# Altium schematic sheet STM32_NEW.SchDoc
size A4
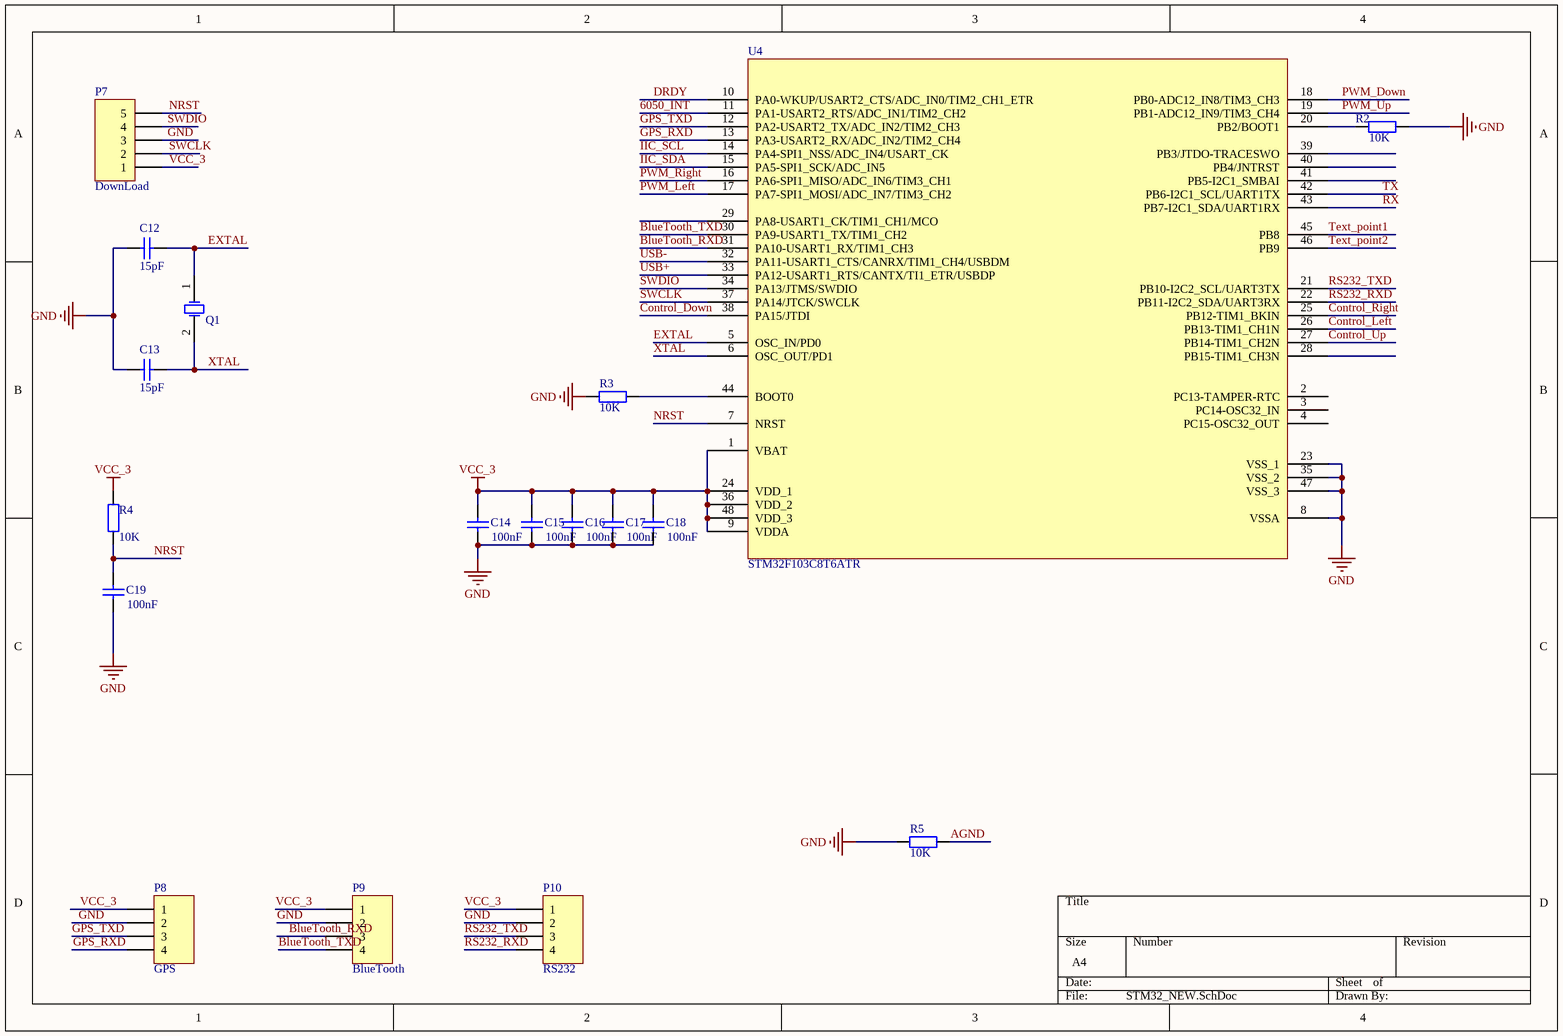
[diagram p0: STM32_NEW.SchDoc]

## Parts
C12  value 15pF  [0603]  (hidden comment: 1pF)
C13  value 15pF  [0603]  (hidden comment: 1pF)
C14  value 100nF  [0603]  (hidden comment: Cap)
C15  value 100nF  [0603]  (hidden comment: Cap)
C16  value 100nF  [0603]  (hidden comment: Cap)
C17  value 100nF  [0603]  (hidden comment: Cap)
C18  value 100nF  [0603]  (hidden comment: Cap)
C19  value 100nF  [0603]  (hidden comment: Cap)
P7  DownLoad  [HDR1X5]
P8  GPS  [HDR1X4]
P9  BlueTooth  [HDR1X4]
P10  RS232  [HDR1X4]
Q1  XTAL  [xtal-5032]  (value not drawn)
R2  value 10K  [0603]  (hidden comment: Res2)
R3  value 10K  [0603]  (hidden comment: Res2)
R4  value 10K  [0603]  (hidden comment: Res2)
R5  value 10K  [0603]  (hidden comment: Res2)
U4  STM32F103C8T6ATR

## Nets
GND: C12.1 C13.1 C14.1 C15.1 C16.1 C17.1 C18.1 C19.1 P7.3 P8.2 P9.2 P10.2 R2.1 R3.2 R5.2 U4.8(VSSA) U4.23(VSS_1) U4.35(VSS_2) U4.47(VSS_3)
VCC_3: C14.2 C15.2 C16.2 C17.2 C18.2 P7.1 P8.1 P9.1 P10.1 R4.2 U4.1(VBAT) U4.9(VDDA) U4.24(VDD_1) U4.36(VDD_2) U4.48(VDD_3)
6050_INT: U4.11(PA1-USART2_RTS/ADC_IN1/TIM2_CH2)
AGND: R5.1
BlueTooth_RXD: P9.3 U4.31(PA10-USART1_RX/TIM1_CH3)
BlueTooth_TXD: P9.4 U4.30(PA9-USART1_TX/TIM1_CH2)
Control_Down: U4.38(PA15/JTDI)
Control_Left: U4.26(PB13-TIM1_CH1N)
Control_Right: U4.25(PB12-TIM1_BKIN)
Control_Up: U4.27(PB14-TIM1_CH2N)
DRDY: U4.10(PA0-WKUP/USART2_CTS/ADC_IN0/TIM2_CH1_ETR)
EXTAL: C12.2 Q1.1(OSC1) U4.5(OSC_IN/PD0)
GPS_RXD: P8.4 U4.13(PA3-USART2_RX/ADC_IN2/TIM2_CH4)
GPS_TXD: P8.3 U4.12(PA2-USART2_TX/ADC_IN2/TIM2_CH3)
IIC_SCL: U4.14(PA4-SPI1_NSS/ADC_IN4/USART_CK)
IIC_SDA: U4.15(PA5-SPI1_SCK/ADC_IN5)
NRST: C19.2 P7.5 R4.1 U4.7(NRST)
PWM_Down: U4.18(PB0-ADC12_IN8/TIM3_CH3)
PWM_Left: U4.17(PA7-SPI1_MOSI/ADC_IN7/TIM3_CH2)
PWM_Right: U4.16(PA6-SPI1_MISO/ADC_IN6/TIM3_CH1)
PWM_Up: U4.19(PB1-ADC12_IN9/TIM3_CH4)
RS232_RXD: P10.4 U4.22(PB11-I2C2_SDA/UART3RX)
RS232_TXD: P10.3 U4.21(PB10-I2C2_SCL/UART3TX)
RX: U4.43(PB7-I2C1_SDA/UART1RX)
SWCLK: P7.2 U4.37(PA14/JTCK/SWCLK)
SWDIO: P7.4 U4.34(PA13/JTMS/SWDIO)
Text_point1: U4.45(PB8)
Text_point2: U4.46(PB9)
TX: U4.42(PB6-I2C1_SCL/UART1TX)
USB+: U4.33(PA12-USART1_RTS/CANTX/TI1_ETR/USBDP)
USB-: U4.32(PA11-USART1_CTS/CANRX/TIM1_CH4/USBDM)
XTAL: C13.2 Q1.2(OSC2) U4.6(OSC_OUT/PD1)
NetR2_2: R2.2 U4.20(PB2/BOOT1)
NetR3_1: R3.1 U4.44(BOOT0)

Not connected (* = marked no-connect by the designer): U4 2(PC13-TAMPER-RTC) 3(PC14-OSC32_IN) 4(PC15-OSC32_OUT) 28(PB15-TIM1_CH3N) 29(PA8-USART1_CK/TIM1_CH1/MCO) 39(PB3/JTDO-TRACESWO) 40(PB4/JNTRST) 41(PB5-I2C1_SMBAI)

## Library data of the parts
C12 C13 = Cap Semi: Capacitor (Semiconductor SIM Model); Published: 8-Jun-2000; LatestRevisionDate: 17-Jul-2002; LatestRevisionNote: Re-released for DXP Platform.; PackageReference: C1206; Publisher: Altium Limited
C14-C19 = Cap: Capacitor; Published: 8-Jun-2000; LatestRevisionDate: 17-Jul-2002; LatestRevisionNote: Re-released for DXP Platform.; PackageReference: RAD-0.3; Publisher: Altium Limited
P7 = Header 5: Header, 5-Pin; LatestRevisionDate: 17-Jul-2002; LatestRevisionNote: Re-released for DXP Platform.; Publisher: Altium Limited
P8-P10 = Header 4: Header, 4-Pin; LatestRevisionDate: 17-Jul-2002; LatestRevisionNote: Re-released for DXP Platform.; Publisher: Altium Limited
Q1 = XTAL: Crystal Oscillator; Published: 8-Jun-2000; LatestRevisionDate: 17-Jul-2002; LatestRevisionNote: Re-released for DXP Platform.; PackageReference: R38; Publisher: Altium Limited
R2-R5 = Res2: Resistor; Published: 8-Jun-2000; LatestRevisionDate: 17-Jul-2002; LatestRevisionNote: Re-released for DXP Platform.; PackageReference: AXIAL-0.4; Publisher: Altium Limited